# EAGLE schematic bf_22_3_3 (EAGLE 6.1)
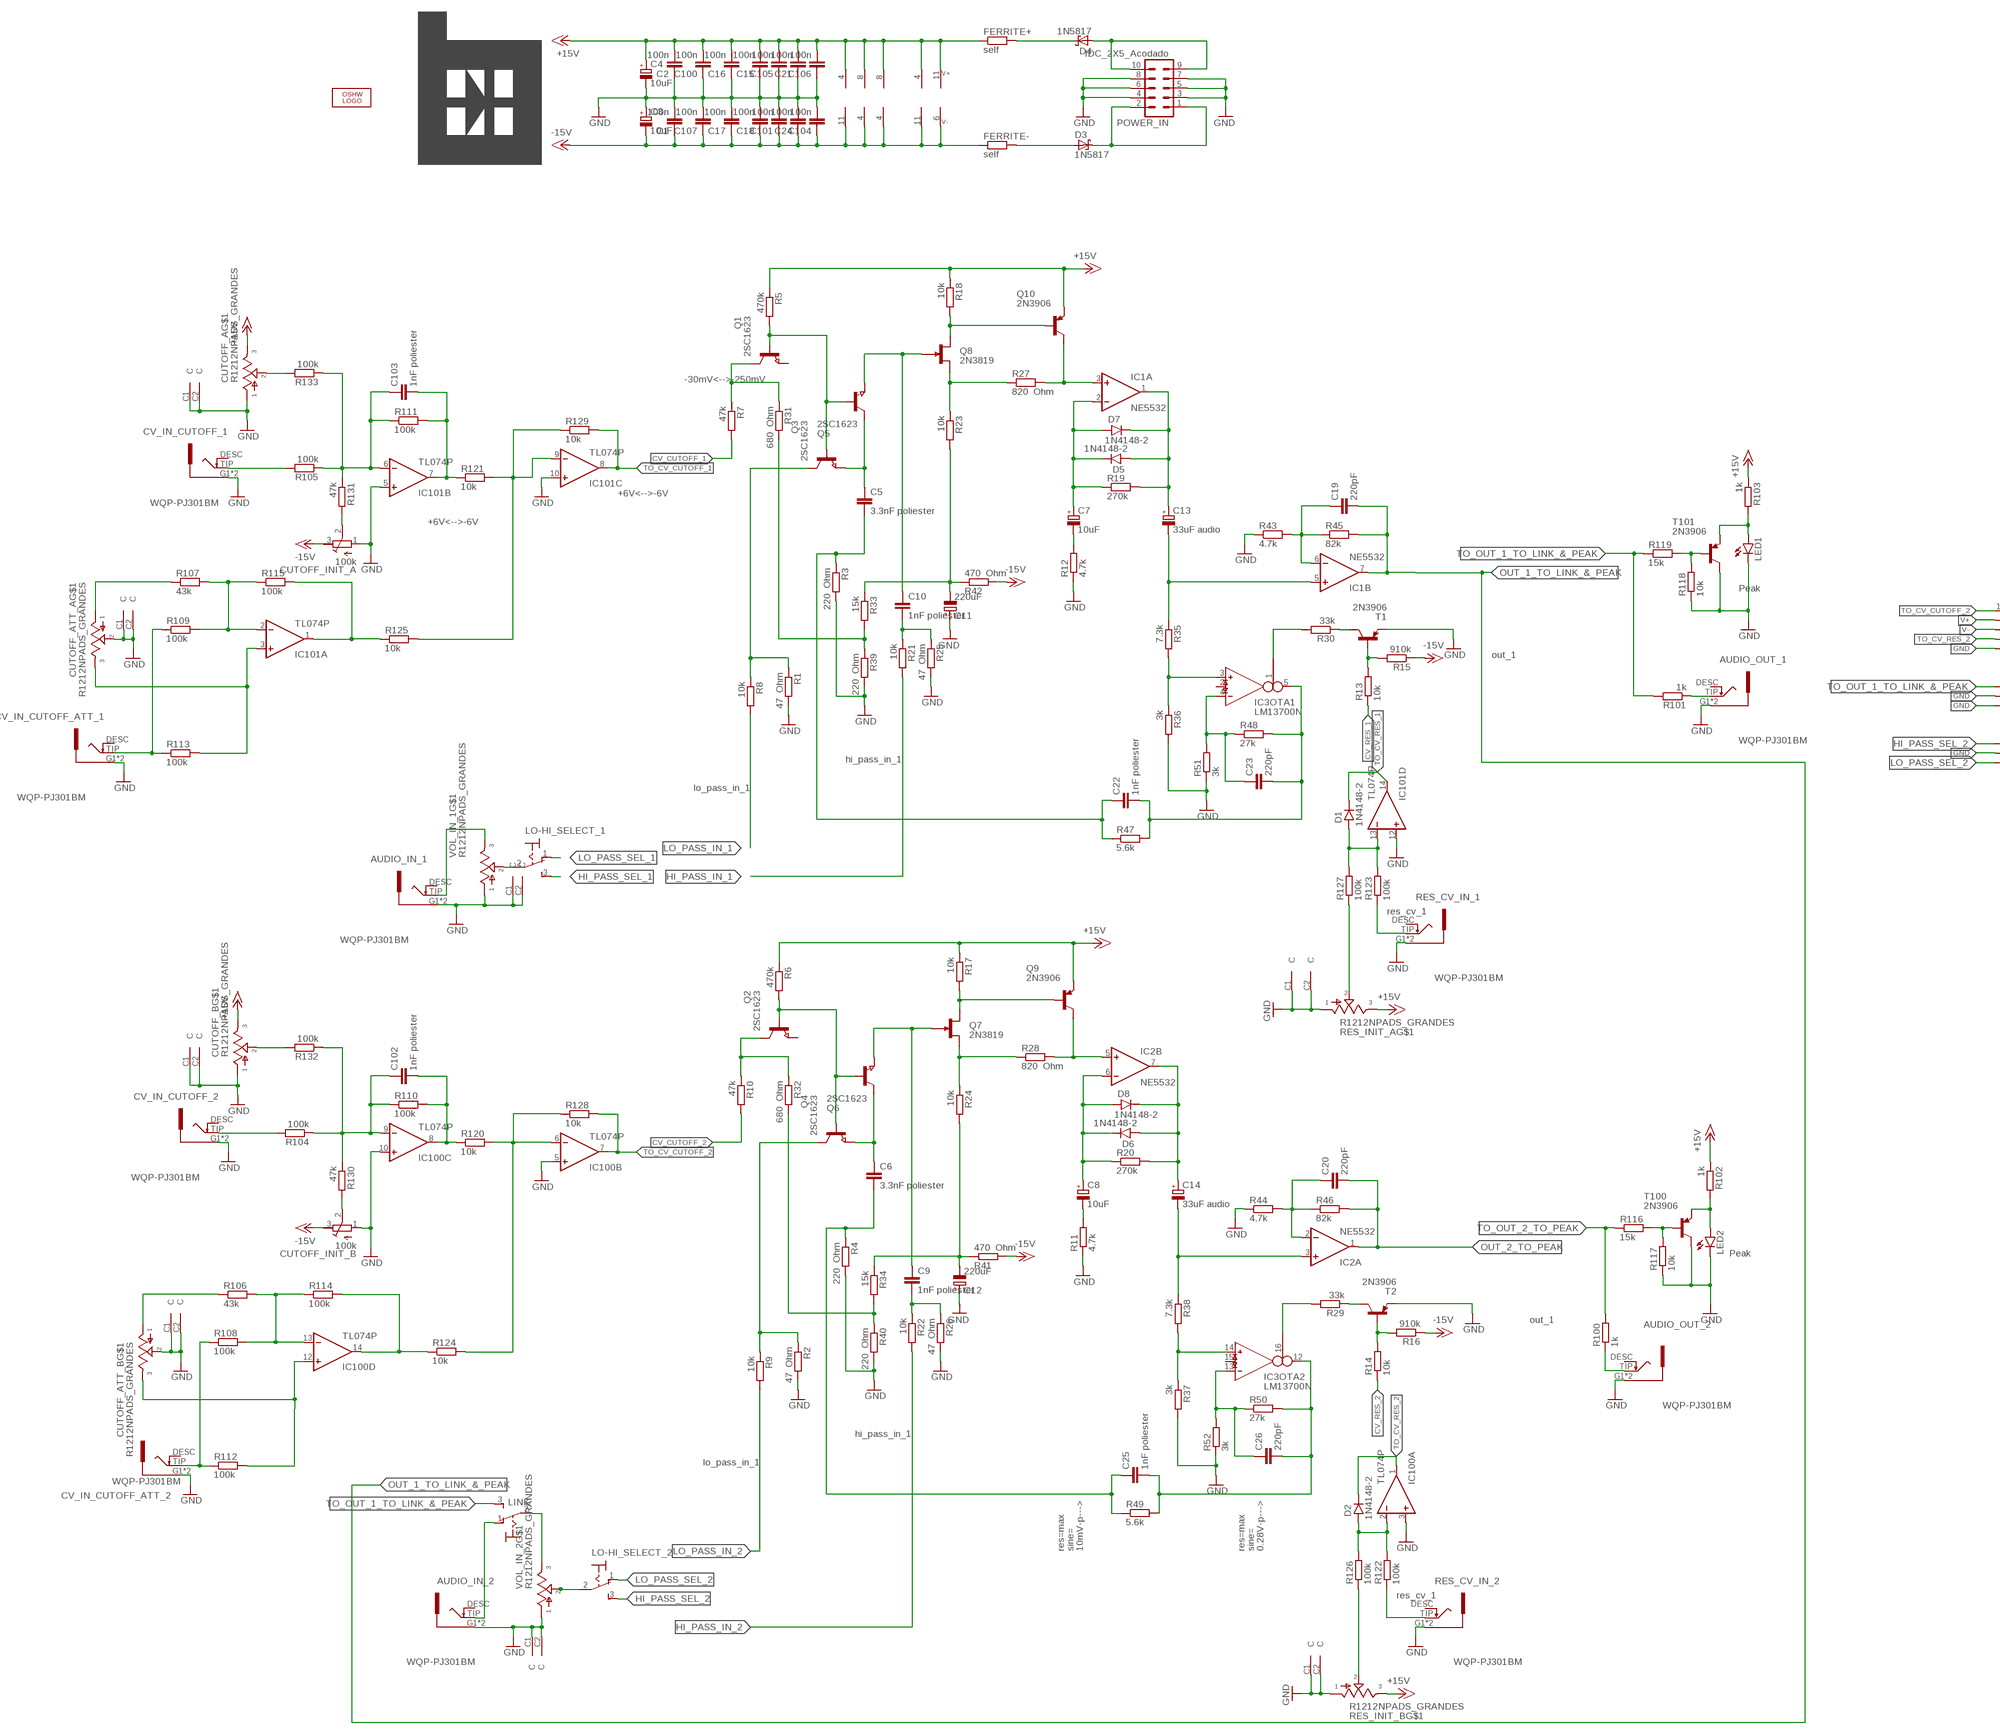
[diagram p0: schematic, sheet 1, part 1 of 2]
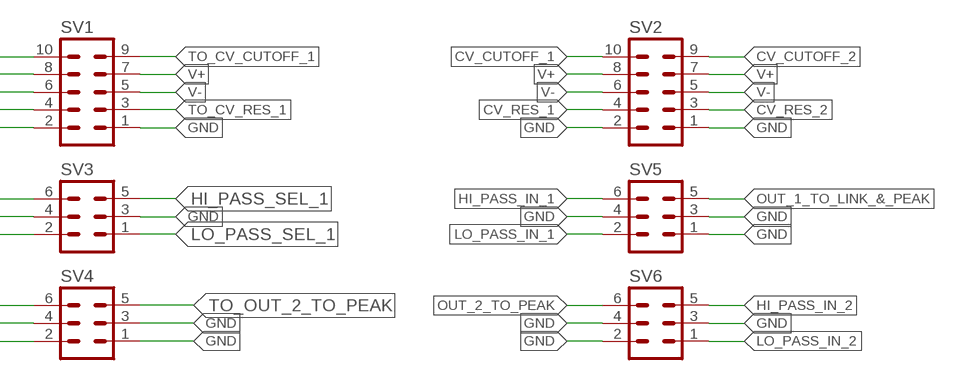
[diagram p1: schematic, sheet 1, part 2 of 2]

## Parts
AUDIO_IN_1  WQP-PJ301BM  [WQP-PJ301BM]
AUDIO_IN_2  WQP-PJ301BM  [WQP-PJ301BM]
AUDIO_OUT_1  WQP-PJ301BM  [WQP-PJ301BM]
AUDIO_OUT_2  WQP-PJ301BM  [WQP-PJ301BM]
C1  100n  C-EU050-025X075  [C050-025X075]
C2  100n  C-EU050-025X075  [C050-025X075]
C3  10uF  CPOL-EUE2-4  [E2-4]
C4  10uF  CPOL-EUE2-4  [E2-4]
C5  3.3nF poliester  C-EU050-025X075  [C050-025X075]
C6  3.3nF poliester  C-EU050-025X075  [C050-025X075]
C7  10uF  CPOL-EUE2.5-5  [E2,5-5]
C8  10uF  CPOL-EUE2.5-5  [E2,5-5]
C9  1nF poliester  C-EU050-025X075  [C050-025X075]
C10  1nF poliester  C-EU050-025X075  [C050-025X075]
C11  220uF  CPOL-EUE2.5-7  [E2,5-7]
C12  220uF  CPOL-EUE2.5-7  [E2,5-7]
C13  33uF audio  CPOL-EUE2.5-6  [E2,5-6]
C14  33uF audio  CPOL-EUE2.5-6  [E2,5-6]
C15  100n  C-EU050-025X075  [C050-025X075]
C16  100n  C-EU050-025X075  [C050-025X075]
C17  100n  C-EU050-025X075  [C050-025X075]
C18  100n  C-EU050-025X075  [C050-025X075]
C19  220pF  C-EU050-025X075  [C050-025X075]
C20  220pF  C-EU050-025X075  [C050-025X075]
C21  100n  C-EU050-025X075  [C050-025X075]
C22  1nF poliester  C-EU050-025X075  [C050-025X075]
C23  220pF  C-EU050-025X075  [C050-025X075]
C24  100n  C-EU050-025X075  [C050-025X075]
C25  1nF poliester  C-EU050-025X075  [C050-025X075]
C26  220pF  C-EU050-025X075  [C050-025X075]
C100  100n  C-EU050-025X075  [C050-025X075]
C101  100n  C-EU050-025X075  [C050-025X075]
C102  1nF poliester  C-EU050-025X075  [C050-025X075]
C103  1nF poliester  C-EU050-025X075  [C050-025X075]
C104  100n  C-EU050-025X075  [C050-025X075]
C105  100n  C-EU050-025X075  [C050-025X075]
C106  100n  C-EU050-025X075  [C050-025X075]
C107  100n  C-EU050-025X075  [C050-025X075]
CUTOFF_A  R1212NPADS_GRANDES  [R121N]
CUTOFF_ATT_A  R1212NPADS_GRANDES  [R121N]
CUTOFF_ATT_B  R1212NPADS_GRANDES  [R121N]
CUTOFF_B  R1212NPADS_GRANDES  [R121N]
CUTOFF_INIT_A  100k  R-TRIMM64X  [RTRIM64X]
CUTOFF_INIT_B  100k  R-TRIMM64X  [RTRIM64X]
CV_IN_CUTOFF_1  WQP-PJ301BM  [WQP-PJ301BM]
CV_IN_CUTOFF_2  WQP-PJ301BM  [WQP-PJ301BM]
CV_IN_CUTOFF_ATT_1  WQP-PJ301BM  [WQP-PJ301BM]
CV_IN_CUTOFF_ATT_2  WQP-PJ301BM  [WQP-PJ301BM]
D1  1N4148-2  [DO35-2]
D2  1N4148-2  [DO35-2]
D3  1N5817  SCHOTTKY-DIODEDO35-7  [DO35-7]
D4  1N5817  SCHOTTKY-DIODEDO35-7  [DO35-7]
D5  1N4148-2  [DO35-2]
D6  1N4148-2  [DO35-2]
D7  1N4148-2  [DO35-2]
D8  1N4148-2  [DO35-2]
FERRITE+  self  R-EU_0204/5  [0204/5]
FERRITE-  self  R-EU_0204/5  [0204/5]
IC1  NE5532  TL072P  [DIL08]
IC2  NE5532  TL072P  [DIL08]
IC3  LM13700N  [DIL16]
IC100  TL074P  [DIL14]
IC101  TL074P  [DIL14]
LED1  LED3MM  [LED3MM]
LED2  LED3MM  [LED3MM]
LINK  M9040P  [M9040P]
LO-HI_SELECT_1  M9040P  [M9040P]
LO-HI_SELECT_2  M9040P  [M9040P]
LOGO100  OSHW_LOGO_FILLX0200-NT  [OSHW_FILLX200_NOTEXT]
POWER_IN  IDC_2X5_Acodado  M05X2RAF  [2X5-RAF]
Q1  2SC1623  [SOT-23]
Q2  2SC1623  [SOT-23]
Q3  2SC1623  [SOT-23]
Q4  2SC1623  [SOT-23]
Q5  2SC1623  [SOT-23]
Q6  2SC1623  [SOT-23]
Q7  2N3819  [TO92F]
Q8  2N3819  [TO92F]
Q9  2N3906  BC556A-PNP-TO92-EBC  [TO92-EBC]
Q10  2N3906  BC556A-PNP-TO92-EBC  [TO92-EBC]
R1  47 Ohm  R-EU_0204/5  [0204/5]
R2  47 Ohm  R-EU_0204/5  [0204/5]
R3  220 Ohm  R-EU_0204/5  [0204/5]
R4  220 Ohm  R-EU_0204/5  [0204/5]
R5  470k  R-EU_0204/5  [0204/5]
R6  470k  R-EU_0204/5  [0204/5]
R7  47k  R-EU_0204/5  [0204/5]
R8  10k  R-EU_0204/5  [0204/5]
R9  10k  R-EU_0204/5  [0204/5]
R10  47k  R-EU_0204/5  [0204/5]
R11  4.7k  R-EU_0204/5  [0204/5]
R12  4.7k  R-EU_0204/5  [0204/5]
R13  10k  R-EU_0204/5  [0204/5]
R14  10k  R-EU_0204/5  [0204/5]
R15  910k  R-EU_0204/5  [0204/5]
R16  910k  R-EU_0204/5  [0204/5]
R17  10k  R-EU_0204/5  [0204/5]
R18  10k  R-EU_0204/5  [0204/5]
R19  270k  R-EU_0204/5  [0204/5]
R20  270k  R-EU_0204/5  [0204/5]
R21  10k  R-EU_0204/5  [0204/5]
R22  10k  R-EU_0204/5  [0204/5]
R23  10k  R-EU_0204/5  [0204/5]
R24  10k  R-EU_0204/5  [0204/5]
R25  47 Ohm  R-EU_0204/5  [0204/5]
R26  47 Ohm  R-EU_0204/5  [0204/5]
R27  820 Ohm  R-EU_0204/5  [0204/5]
R28  820 Ohm  R-EU_0204/5  [0204/5]
R29  33k  R-EU_0204/5  [0204/5]
R30  33k  R-EU_0204/5  [0204/5]
R31  680 Ohm  R-EU_0204/5  [0204/5]
R32  680 Ohm  R-EU_0204/5  [0204/5]
R33  15k  R-EU_0204/5  [0204/5]
R34  15k  R-EU_0204/5  [0204/5]
R35  7.3k  R-EU_0204/5  [0204/5]
R36  3k  R-EU_0204/5  [0204/5]
R37  3k  R-EU_0204/5  [0204/5]
R38  7.3k  R-EU_0204/5  [0204/5]
R39  220 Ohm  R-EU_0204/5  [0204/5]
R40  220 Ohm  R-EU_0204/5  [0204/5]
R41  470 Ohm  R-EU_0204/5  [0204/5]
R42  470 Ohm  R-EU_0204/5  [0204/5]
R43  4.7k  R-EU_0204/5  [0204/5]
R44  4.7k  R-EU_0204/5  [0204/5]
R45  82k  R-EU_0204/5  [0204/5]
R46  82k  R-EU_0204/5  [0204/5]
R47  5.6k  R-EU_0204/5  [0204/5]
R48  27k  R-EU_0204/5  [0204/5]
R49  5.6k  R-EU_0204/5  [0204/5]
R50  27k  R-EU_0204/5  [0204/5]
R51  3k  R-EU_0204/5  [0204/5]
R52  3k  R-EU_0204/5  [0204/5]
R100  1k  R-EU_0204/5  [0204/5]
R101  1k  R-EU_0204/5  [0204/5]
R102  1k  R-EU_0204/5  [0204/5]
R103  1k  R-EU_0204/5  [0204/5]
R104  100k  R-EU_0204/5  [0204/5]
R105  100k  R-EU_0204/5  [0204/5]
R106  43k  R-EU_0204/5  [0204/5]
R107  43k  R-EU_0204/5  [0204/5]
R108  100k  R-EU_0204/5  [0204/5]
R109  100k  R-EU_0204/5  [0204/5]
R110  100k  R-EU_0204/5  [0204/5]
R111  100k  R-EU_0204/5  [0204/5]
R112  100k  R-EU_0204/5  [0204/5]
R113  100k  R-EU_0204/5  [0204/5]
R114  100k  R-EU_0204/5  [0204/5]
R115  100k  R-EU_0204/5  [0204/5]
R116  15k  R-EU_0204/5  [0204/5]
R117  10k  R-EU_0204/5  [0204/5]
R118  10k  R-EU_0204/5  [0204/5]
R119  15k  R-EU_0204/5  [0204/5]
R120  10k  R-EU_0204/5  [0204/5]
R121  10k  R-EU_0204/5  [0204/5]
R122  100k  R-EU_0204/5  [0204/5]
R123  100k  R-EU_0204/5  [0204/5]
R124  10k  R-EU_0204/5  [0204/5]
R125  10k  R-EU_0204/5  [0204/5]
R126  100k  R-EU_0204/5  [0204/5]
R127  100k  R-EU_0204/5  [0204/5]
R128  10k  R-EU_0204/5  [0204/5]
R129  10k  R-EU_0204/5  [0204/5]
R130  47k  R-EU_0204/5  [0204/5]
R131  47k  R-EU_0204/5  [0204/5]
R132  100k  R-EU_0204/5  [0204/5]
R133  100k  R-EU_0204/5  [0204/5]
RES_CV_IN_1  WQP-PJ301BM  [WQP-PJ301BM]
RES_CV_IN_2  WQP-PJ301BM  [WQP-PJ301BM]
RES_INIT_A  R1212NPADS_GRANDES  [R121N]
RES_INIT_B  R1212NPADS_GRANDES  [R121N]
SV1  MA05-2T  [MA05-2]
SV2  MA05-2T  [MA05-2]
SV3  MA03-2  [MA03-2]
SV4  MA03-2  [MA03-2]
SV5  MA03-2  [MA03-2]
SV6  MA03-2  [MA03-2]
T1  2N3906  2N3906-PNP-TO92-EBC  [TO92-EBC]
T2  2N3906  2N3906-PNP-TO92-EBC  [TO92-EBC]
T100  2N3906  2N3906-PNP-TO92-EBC  [TO92-EBC]
T101  2N3906  2N3906-PNP-TO92-EBC  [TO92-EBC]
U$100  LOGOBEFACOCONLETRAS  [LOGOBEFACOCONLETRAS]
VOL_IN_1  R1212NPADS_GRANDES  [R121N]
VOL_IN_2  R1212NPADS_GRANDES  [R121N]

## Nets
ATT_LOW_1: CUTOFF_ATT_A.PIN3 IC101.3(A:+IN) R113.2
ATT_LOW_2: CUTOFF_ATT_B.PIN3 IC100.12(D:+IN) R112.2
CV_CUTOFF_1: R7.2 SV2.10
CV_CUTOFF_2: R10.2 SV2.9
CV_RES_1: R13.1 SV2.4
CV_RES_2: R14.1 SV2.3
GND: AUDIO_IN_1.G1(SLEVE) AUDIO_IN_1.G2(SLEVE) AUDIO_IN_2.G1(SLEVE) AUDIO_IN_2.G2(SLEVE) AUDIO_OUT_1.G1(SLEVE) AUDIO_OUT_1.G2(SLEVE) AUDIO_OUT_2.G1(SLEVE) AUDIO_OUT_2.G2(SLEVE) C1.2 C2.1 C3.+ C4.- C11.+ C12.+ C15.1 C16.1 C17.2 C18.2 C21.1 C24.2 C100.1 C101.2 C104.2 C105.1 C106.1 C107.2 CUTOFF_A.C1(C) CUTOFF_A.C2(C) CUTOFF_A.PIN1 CUTOFF_ATT_A.C1(C) CUTOFF_ATT_A.C2(C) CUTOFF_ATT_A.PIN2 CUTOFF_ATT_B.C1(C) CUTOFF_ATT_B.C2(C) CUTOFF_ATT_B.PIN2 CUTOFF_B.C1(C) CUTOFF_B.C2(C) CUTOFF_B.PIN1 CUTOFF_INIT_A.1(E) CUTOFF_INIT_B.1(E) CV_IN_CUTOFF_1.G1(SLEVE) CV_IN_CUTOFF_1.G2(SLEVE) CV_IN_CUTOFF_2.G1(SLEVE) CV_IN_CUTOFF_2.G2(SLEVE) CV_IN_CUTOFF_ATT_1.G1(SLEVE) CV_IN_CUTOFF_ATT_1.G2(SLEVE) CV_IN_CUTOFF_ATT_2.G1(SLEVE) CV_IN_CUTOFF_ATT_2.G2(SLEVE) IC100.3(A:+IN) IC100.5(B:+IN) IC100.10(C:+IN) IC101.5(B:+IN) IC101.10(C:+IN) IC101.12(D:+IN) LED1.K(C) LED2.K(C) POWER_IN.3 POWER_IN.4 POWER_IN.5 POWER_IN.6 POWER_IN.7 POWER_IN.8 R1.2 R2.2 R3.2 R4.2 R11.1 R12.1 R25.2 R26.2 R36.2 R37.2 R39.2 R40.2 R43.1 R44.1 R51.1 R52.1 R117.1 R118.1 RES_CV_IN_1.G1(SLEVE) RES_CV_IN_1.G2(SLEVE) RES_CV_IN_2.G1(SLEVE) RES_CV_IN_2.G2(SLEVE) RES_INIT_A.C1(C) RES_INIT_A.C2(C) RES_INIT_A.PIN1 RES_INIT_B.C1(C) RES_INIT_B.C2(C) RES_INIT_B.PIN1 SV1.1 SV1.2 SV2.1 SV2.2 SV3.2 SV3.3 SV3.4 SV4.1 SV4.3 SV4.4 SV5.1 SV5.3 SV5.4 SV6.2 SV6.3 SV6.4 T1.E T2.E T100.C T101.C VOL_IN_1.C1(C) VOL_IN_1.C2(C) VOL_IN_1.PIN1 VOL_IN_2.C1(C) VOL_IN_2.C2(C) VOL_IN_2.PIN1
HI_PASS_IN_1: R21.2 SV5.6
HI_PASS_IN_2: R22.2 SV6.5
HI_PASS_SEL_1: LO-HI_SELECT_1.3(S) SV3.5
HI_PASS_SEL_2: LO-HI_SELECT_2.3(S) SV4.6
LO_PASS_IN_1: R8.2 SV5.2
LO_PASS_IN_2: R9.2 SV6.1
LO_PASS_SEL_1: LO-HI_SELECT_1.1(O) SV3.1
LO_PASS_SEL_2: LO-HI_SELECT_2.1(O) SV4.2
N$1: CV_IN_CUTOFF_ATT_1.TIP R109.1 R113.1
N$2: C7.+ D5.C D7.A IC1.2(A:-IN) R19.1
N$3: C13.- IC1.5(B:+IN) R35.1
N$4: C7.- R12.2
N$5: C22.2 C23.2 IC3.5(OTA1:OUT) R47.2 R48.2
N$6: LED2.A R102.2 T100.E
N$7: C11.- R23.2 R33.1 R42.1
N$8: C23.1 IC3.4(OTA1:IN_N) R48.1 R51.2
N$9: C5.2 C22.1 R3.1 R47.1
N$10: IC3.3(OTA1:IN_P) R35.2 R36.1
N$11: Q3.3(C) R1.1 R8.1
N$12: C10.2 R21.1 R25.1
N$13: LED1.A R103.2 T101.E
N$14: IC101.9(C:-IN) R121.2 R125.2 R129.1
N$15: R116.2 R117.2 T100.B
N$16: R118.2 R119.2 T101.B
N$17: CUTOFF_ATT_A.PIN1 R107.1
N$18: R31.2 R33.2 R39.1
N$19: R30.1 T1.C
N$20: IC3.1(OTA1:I_BIAS) R30.2
N$21: AUDIO_OUT_1.TIP R101.1
N$22: R13.2 R15.2 T1.B
N$23: D1.A IC101.13(D:-IN) R123.2 R127.2
N$24: AUDIO_OUT_2.TIP R100.1
N$25: D3.A FERRITE-.2
N$26: CV_IN_CUTOFF_ATT_2.TIP R108.1 R112.1
N$27: CUTOFF_ATT_B.PIN1 R106.1
N$28: CUTOFF_INIT_A.2(S) R131.2
N$29: CUTOFF_B.PIN2 R132.2
N$30: D4.C FERRITE+.2
N$31: C5.1 Q3.2(E) Q5.3(C)
N$32: Q1.3(C) R7.1 R31.1
N$33: Q1.1(B) Q3.1(B) Q5.1(B) R5.2
N$34: CV_IN_CUTOFF_2.TIP R104.2
N$35: LO-HI_SELECT_1.2(P) VOL_IN_1.PIN2
N$36: C8.+ D6.C D8.A IC2.6(B:-IN) R20.1
N$37: C14.- IC2.3(A:+IN) R38.1
N$38: C25.2 C26.2 IC3.12(OTA2:OUT) R49.2 R50.2
N$39: D3.C POWER_IN.1 POWER_IN.2
N$40: D4.A POWER_IN.9 POWER_IN.10
N$41: C14.+ D6.A D8.C IC2.7(B:OUT) R20.2
N$42: C13.+ D5.A D7.C IC1.1(A:OUT) R19.2
N$43: C19.1 IC1.6(B:-IN) R43.2 R45.1
N$44: CUTOFF_A.PIN2 R133.2
N$45: CV_IN_CUTOFF_1.TIP R105.2
N$46: Q8.S R23.1 R27.1
N$47: C20.1 IC2.2(A:-IN) R44.2 R46.1
N$48: R122.1 RES_CV_IN_2.TIP
N$49: C103.1 IC101.6(B:-IN) R105.1 R111.1 R131.1 R133.1
N$50: R126.1 RES_INIT_B.PIN2
N$51: C6.2 C25.1 R4.1 R49.1
N$52: C8.- R11.2
N$53: C9.2 R22.1 R26.1
N$54: R123.1 RES_CV_IN_1.TIP
N$56: R127.1 RES_INIT_A.PIN2
N$57: R32.2 R34.2 R40.1
N$59: IC101.2(A:-IN) R107.2 R109.2 R115.1
N$61: Q4.3(C) R2.1 R9.1
N$62: IC101.1(A:OUT) R115.2 R125.1
N$64: CUTOFF_INIT_B.2(S) R130.2
N$66: C102.1 IC100.9(C:-IN) R104.1 R110.1 R130.1 R132.1
N$67: IC100.6(B:-IN) R120.2 R124.2 R128.1
N$71: C6.1 Q4.2(E) Q6.3(C)
N$72: Q2.3(C) R10.1 R32.1
N$73: Q8.D Q10.B R18.2
N$74: Q2.1(B) Q4.1(B) Q6.1(B) R6.2
N$75: C10.1 Q5.2(E) Q8.G
N$76: IC1.3(A:+IN) Q10.C R27.2
N$77: Q7.S R24.1 R28.1
N$78: Q7.D Q9.B R17.2
N$79: C9.1 Q6.2(E) Q7.G
N$80: C103.2 IC101.7(B:OUT) R111.2 R121.1
N$81: IC2.5(B:+IN) Q9.C R28.2
N$82: C12.- R24.2 R34.1 R41.1
N$85: C102.2 IC100.8(C:OUT) R110.2 R120.1
N$86: C26.1 IC3.13(OTA2:IN_N) R50.1 R52.2
N$87: IC3.14(OTA2:IN_P) R37.1 R38.2
N$89: R29.1 T2.C
N$90: IC3.16(OTA2:I_BIAS) R29.2
N$92: R14.2 R16.2 T2.B
N$93: D2.A IC100.2(A:-IN) R122.2 R126.2
N$99: IC100.13(D:-IN) R106.2 R108.2 R114.1
N$101: IC100.14(D:OUT) R114.2 R124.1
N$106: LO-HI_SELECT_2.2(P) VOL_IN_2.PIN2
N$107: LINK.2(P) VOL_IN_2.PIN3
N$108: AUDIO_IN_1.TIP VOL_IN_1.PIN3
N$109: AUDIO_IN_2.TIP LINK.1(O)
OUT_1_TO_LINK_&_PEAK: C19.2 IC1.7(B:OUT) R45.2 SV5.5
OUT_2_TO_PEAK: C20.2 IC2.1(A:OUT) R46.2 SV6.6
TO_CV_CUTOFF_1: IC101.8(C:OUT) R129.2 SV1.9
TO_CV_CUTOFF_2: IC100.7(B:OUT) R128.2 SV1.10
TO_CV_RES_1: D1.C IC101.14(D:OUT) SV1.3
TO_CV_RES_2: D2.C IC100.1(A:OUT) SV1.4
TO_OUT_1_TO_LINK_&_PEAK: LINK.3(S) R101.2 R119.1 SV3.6
TO_OUT_2_TO_PEAK: R100.2 R116.1 SV4.5
V+: C2.2 C4.+ C15.2 C16.2 C21.2 C100.2 C105.2 C106.2 CUTOFF_A.PIN3 CUTOFF_B.PIN3 FERRITE+.1 IC1.8(P:V+) IC2.8(P:V+) IC3.11(SUPPLY:V+) IC100.4(P:V+) IC101.4(P:V+) Q9.E Q10.E R5.1 R6.1 R17.1 R18.1 R102.1 R103.1 RES_INIT_A.PIN3 RES_INIT_B.PIN3 SV1.7 SV1.8 SV2.7 SV2.8 ; supply symbol labelled +15V
V-: C1.1 C3.- C17.1 C18.1 C24.1 C101.1 C104.1 C107.1 CUTOFF_INIT_A.3(A) CUTOFF_INIT_B.3(A) FERRITE-.1 IC1.4(P:V-) IC2.4(P:V-) IC3.6(SUPPLY:V-) IC100.11(P:V-) IC101.11(P:V-) R15.1 R16.1 R41.2 R42.2 SV1.5 SV1.6 SV2.5 SV2.6 ; supply symbol labelled -15V
Unconnected: AUDIO_IN_1.DESC(SWITCH) AUDIO_IN_2.DESC(SWITCH) AUDIO_OUT_1.DESC(SWITCH) AUDIO_OUT_2.DESC(SWITCH) CV_IN_CUTOFF_1.DESC(SWITCH) CV_IN_CUTOFF_2.DESC(SWITCH) CV_IN_CUTOFF_ATT_1.DESC(SWITCH) CV_IN_CUTOFF_ATT_2.DESC(SWITCH) IC3.2(OTA1:I_DIODE) IC3.7(BUF1:B) IC3.8(BUF1:E) IC3.9(BUF2:E) IC3.10(BUF2:B) IC3.15(OTA2:I_DIODE) Q1.2(E) Q2.2(E) RES_CV_IN_1.DESC(SWITCH) RES_CV_IN_2.DESC(SWITCH)

## Notes on the sheet
- -30mV<-->-250mV
- +6V<-->-6V
- +6V<-->-6V
- Peak
- out_1
- hi_pass_in_1
- lo_pass_in_1
- res_cv_1
- Peak
- out_1
- hi_pass_in_1
- lo_pass_in_1
- res=max | sine= | 10mV-p---> | res=max | sine= | 0.28V-p--->
- res_cv_1

## Library data of the parts
AUDIO_IN_1 AUDIO_IN_2 AUDIO_OUT_1 AUDIO_OUT_2 CV_IN_CUTOFF_1 CV_IN_CUTOFF_2 CV_IN_CUTOFF_ATT_1 CV_IN_CUTOFF_ATT_2 RES_CV_IN_1 RES_CV_IN_2 = minijack_3_5_quingpu:WQP-PJ301BM
C1 C2 C5 C6 C9 C10 C15-C26 C100-C107 = rcl:C-EU: CAPACITOR, European symbol
C3 C4 C7 C8 C11-C14 = rcl:CPOL-EU: POLARIZED CAPACITOR, European symbol
CUTOFF_A CUTOFF_ATT_A CUTOFF_ATT_B CUTOFF_B RES_INIT_A RES_INIT_B VOL_IN_1 VOL_IN_2 = pot_12mm_r1212n:R1212N
CUTOFF_INIT_A CUTOFF_INIT_B = rcl:R-TRIMM: Trimm resistor
D1 D2 D5-D8 = gm-diodes:1N4148: Fast Switching Diode DO-35 glass case a.k.a. 1N914
D3 D4 = diode:SCHOTTKY-DIODE: Schottky Diode
FERRITE+ FERRITE- R1-R52 R100-R133 = rcl:R-EU_: RESISTOR, European symbol
IC1 IC2 = linear:TL072: OP AMP
IC3 = ota:LM13700: Dual OTA with buffers
IC100 IC101 = linear:TL074: OP AMP
LED1 LED2 = gm-diodes:LED
LINK LO-HI_SELECT_1 LO-HI_SELECT_2 = switch:M9040P: TOGGLE SWITCH Marquardt
LOGO100 = ohw-logo:OSHW_LOGO_FILL
POWER_IN = SparkFun:M05X2: Header 5x2 Standard 10-pin dual row 0.1" header. Commonly used with AVR-ISP. Use with Spark Fun Electronics SKU: PRT-00778
Q1-Q6 = 2sc1623:2SC1623
Q7 Q8 = transistor-small-signal:2N3819: N-CHANNEL FET
Q9 Q10 = transistor:*-PNP-: PNP Transistror
SV1 SV2 = con-lstb:MA05-2: PIN HEADER
SV3-SV6 = con-lstb:MA03-2: PIN HEADER
T1 T2 T100 T101 = transistor-neu-to92:*-PNP-: PNP Transistror
U$100 = logo befaco:LOGOBEFACOCONLETRAS